# Altium schematic sheet DB10012_ControlController.SchDoc: Microcontroller
size A3; SheetNumber: 5; SheetTotal: 6
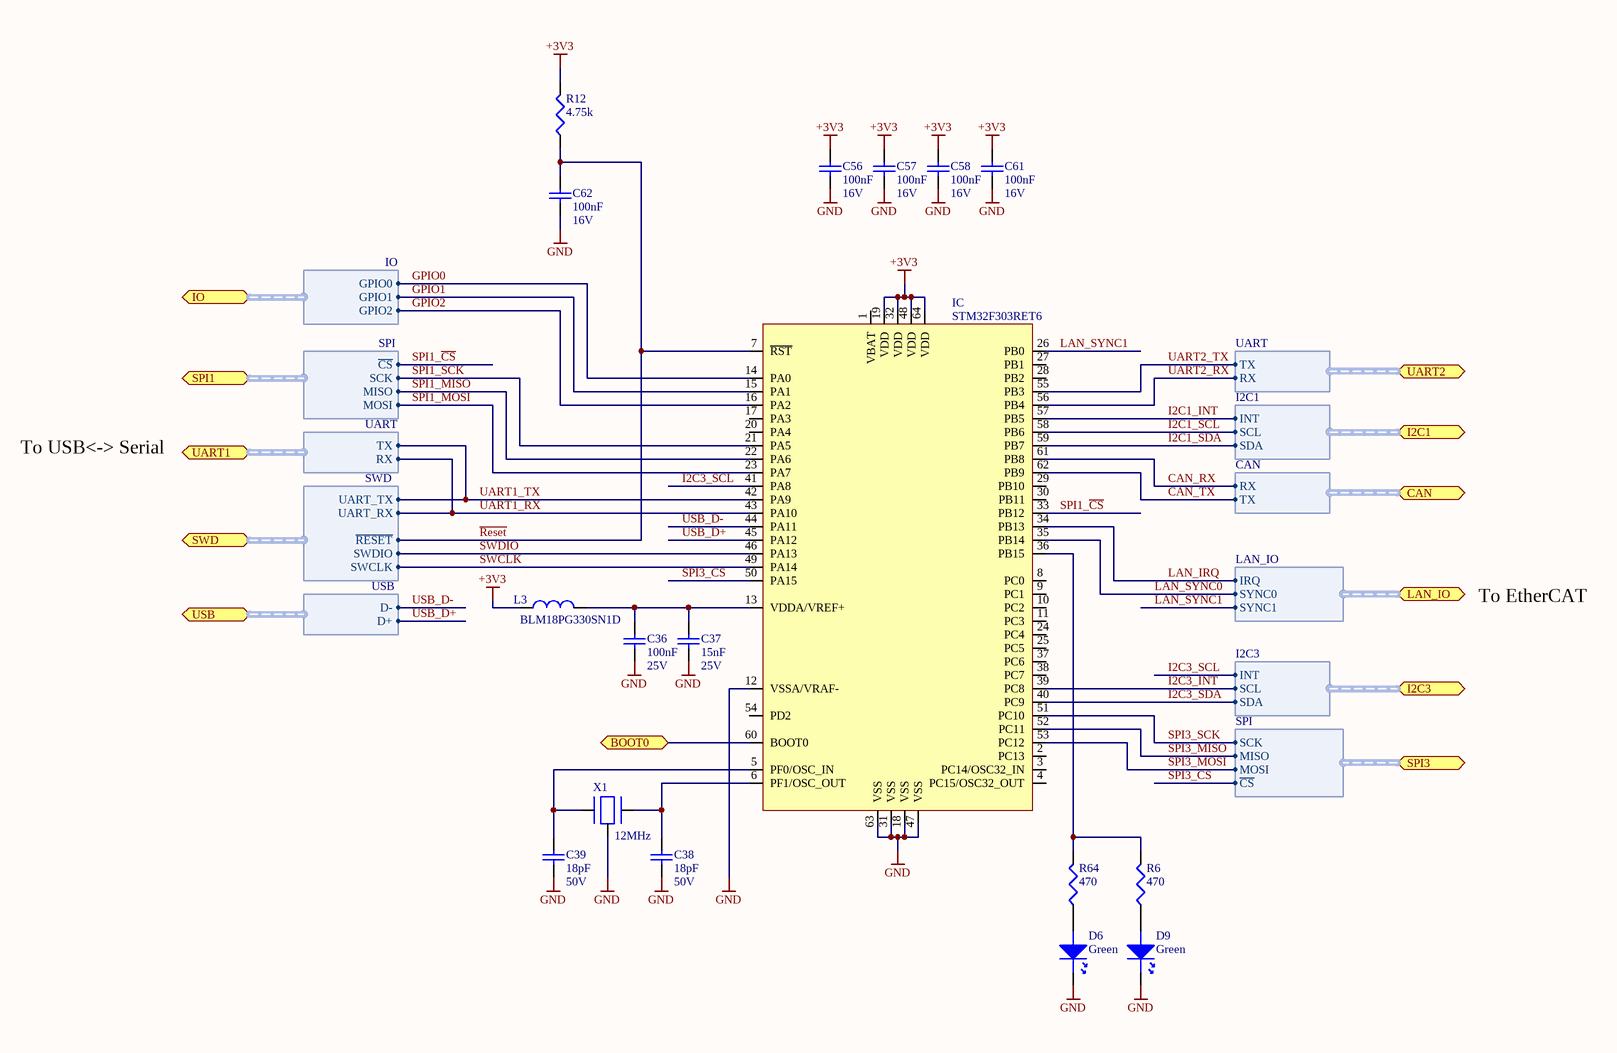
[diagram p0: DB10012_ControlController.SchDoc]

## Parts
C36  100nF  Voltage Rating: 25V  [C0402]
C37  15nF  Voltage Rating: 25V  [C0402]
C38  18pF  Voltage Rating: 50V  [C0402]
C39  18pF  Voltage Rating: 50V  [C0402]
C56  100nF  Voltage Rating: 16V  [C0402]
C57  100nF  Voltage Rating: 16V  [C0402]
C58  100nF  Voltage Rating: 16V  [C0402]
C61  100nF  Voltage Rating: 16V  [C0402]
C62  100nF  Voltage Rating: 16V  [C0402]
D6  Green  [D-0805]
D9  Green  [D-0805]
IC  STM32F303RET6  [LQFP64]
L3  BLM18PG330SN1D  [L0603]
R6  470  [0402]
R12  4.75k  [0402]
R64  470  [0402]
X1  12MHz  [7M]

## Ports
BOOT0, CAN (harness CAN), I2C1 (harness I2C1), I2C3 (harness I2C3), IO (harness IO), LAN_IO (harness LAN_IO), SPI1 (harness SPI), SPI3 (harness SPI), SWD (harness SWD), UART1 (harness UART), UART2 (harness UART), USB (harness USB)

## Harnesses
SWD: UART_TX, UART_RX, SWDIO, SWCLK, ~{RESET}
SPI: SCK, ~{CS}, MOSI, MISO
LAN_IO: IRQ, SYNC0, SYNC1
UART: TX, RX
USB: D-, D+
CAN: TX, RX
I2C1: INT, SCL, SDA
IO: GPIO0, GPIO1, GPIO2
I2C3: INT, SCL, SDA

## Nets
+3V3: C56.2 C57.2 C58.2 C61.2 IC.19(VDD) IC.32(VDD) IC.48(VDD) IC.64(VDD) L3.2 R12.2
GND: C36.1 C37.1 C38.1 C39.1 C56.1 C57.1 C58.1 C61.1 C62.1 D6.K D9.K IC.12(VSSA/VRAF-) IC.18(VSS) IC.31(VSS) IC.47(VSS) IC.63(VSS) X1.0
BOOT0: IC.60(BOOT0) ; port BOOT0
CAN_RX: IC.61(PB8) ; port CAN.RX
CAN_TX: IC.62(PB9) ; port CAN.TX
GPIO0: IC.14(PA0) ; port IO.GPIO0
GPIO1: IC.15(PA1) ; port IO.GPIO1
GPIO2: IC.16(PA2) ; port IO.GPIO2
I2C1_INT: IC.57(PB5) ; port I2C1.INT
I2C1_SCL: IC.58(PB6) ; port I2C1.SCL
I2C1_SDA: IC.59(PB7) ; port I2C1.SDA
I2C3_INT: IC.39(PC8) ; port I2C3.SCL
I2C3_SCL: IC.41(PA8) ; port I2C3.INT
I2C3_SDA: IC.40(PC9) ; port I2C3.SDA
LAN_IRQ: IC.34(PB13) ; port LAN_IO.IRQ
LAN_SYNC0: IC.35(PB14) ; port LAN_IO.SYNC0
LAN_SYNC1: IC.26(PB0) ; port LAN_IO.SYNC1
~{Reset}: C62.2 IC.7(~{RST}) R12.1 ; port SWD.~{RESET}
SPI1_~{CS}: IC.33(PB12) ; port SPI1.~{CS}
SPI1_MISO: IC.22(PA6) ; port SPI1.MISO
SPI1_MOSI: IC.23(PA7) ; port SPI1.MOSI
SPI1_SCK: IC.21(PA5) ; port SPI1.SCK
SPI3_~{CS}: IC.50(PA15) ; port SPI3.~{CS}
SPI3_MISO: IC.52(PC11) ; port SPI3.MISO
SPI3_MOSI: IC.53(PC12) ; port SPI3.MOSI
SPI3_SCK: IC.51(PC10) ; port SPI3.SCK
SWCLK: IC.49(PA14) ; port SWD.SWCLK
SWDIO: IC.46(PA13) ; port SWD.SWDIO
UART1_RX: IC.43(PA10) ; port SWD.UART_RX, port UART1.RX
UART1_TX: IC.42(PA9) ; port SWD.UART_TX, port UART1.TX
UART2_RX: IC.56(PB4) ; port UART2.RX
UART2_TX: IC.55(PB3) ; port UART2.TX
USB_D+: IC.45(PA12) ; port USB.D+
USB_D-: IC.44(PA11) ; port USB.D-
NetC36_2: C36.2 C37.2 IC.13(VDDA/VREF+) L3.1
NetC38_2: C38.2 IC.6(PF1/OSC_OUT) X1.1
NetC39_2: C39.2 IC.5(PF0/OSC_IN) X1.2
NetD6_A: D6.A R64.1
NetD9_A: D9.A R6.1
NetIC_36: IC.36(PB15) R6.2 R64.2

Not connected (* = marked no-connect by the designer): IC 1(VBAT) 2(PC13) 3(PC14/OSC32_IN) 4(PC15/OSC32_OUT) 8(PC0) 9(PC1) 10(PC2) 11(PC3) 17(PA3) 20(PA4) 24(PC4) 25(PC5) 27(PB1) 28(PB2) 29(PB10) 30(PB11) 37(PC6) 38(PC7) 54(PD2)

## Notes on the sheet
- To USB<-> Serial
- To EtherCAT
- Title
- Size:
- Date:
- A3
- Number:
- Time:
- Revision:
- Sheet
- of
- File:

## Library data of the parts
C36 = 100nF/0402/CER/25V: Capacitor, 100nF, 25V, X7R; Capacitance Tolerance: 10nF; Capacitor Case Style: 0402; Brand Number: GRM155R71E104KE14D; Brand: MULTICOMP; Dielectric Characteristic: X7R; Capacitance: 100nF; Temperature Range: -55 to +125 C; Price: 0,0225; Order Code Supplier: 2456106; Supplier: Farnell
C37 = 15nF/0402/CER/25V: Capacitor, 15nF, 25V, X7R; Capacitance Tolerance: +/-10%; Capacitor Case Style: 0402; Brand Number: GRM155R71E153KA61D; Brand: Murata; Dielectric Characteristic: X7R; Capacitance: 15nF; Temperature Range: -55°C to 125°C; Price: 0,0267; Order Code Supplier: 2470470; Supplier: Farnell
C38 C39 = 18pF/0402/CER/50V: Capacitor, 18pF, 50V, NP0; Capacitance Tolerance: ± 5%; Capacitor Case Style: 0402; Brand Number: GRM1555C1H180JA01D; Brand: MURATA; Dielectric Characteristic: NP0; Capacitance: 18pF; Temperature Range: -55°C to 125°C; Price: 0,0177; Order Code Supplier: 1828876; Supplier: Farnell
C56-C58 C61 C62 = 100nF/0402/CER/16V: Capacitor, 100nF, 16V, X7R; Capacitance Tolerance: 10nF; Capacitor Case Style: 0402; Brand Number: GRM155R71C104KA88D; Brand: MURATA; Dielectric Characteristic: X7R; Capacitance: 100nF; Temperature Range: -55 to +125 C; Price: 0,001; Order Code Supplier: 2408523; Supplier: Farnell
D6 D9 = KP-2012SGC: Led, Green, Li:12mcd, Vf:2.2V, If:0.02A; Brand: KingBright; Case Style: 0805; Forward Current: 0.02A; Forward Voltage: 2.2V; Luminous Intensity: 12mcd; Brand Number: KP-2012SGC; Order Code Supplier: 1318243; Price: 0,06; Supplier: Farnell; Temperature Range: -30°C to +85°C
IC = STM32F303RET6: ARM Cortex-M4, 72 MHz, 512 KB, 64 KB, 64; Brand: STM; Brand Number: STM32F303RET6; Supplier: Farnell; Order Code Supplier: 2466939
L3 = BLM18PG330SN1D: Ferrite Bead, Impedance:33ohm, DC Resistance Max:0.025ohm, DC Current Rating:3A; Brand: MURATA; Case Style: 0603; Brand Number: BLM18PG330SN1D; Price: 0,048; Supplier: Farnell; Order Code Supplier: 1515742
R6 R64 = 470/0402/0063W/50V: Resistor, 470, 1%, 0.0625W, 50V, 100PPM, 0402; Brand: VISHAY DRALORIC; Brand Number: CRG0402F470R; Power Rating: 0.063W; Case Style: 0402; Order Code Supplier: 2331533; Price: 0,0099; Resistance: 470; Supplier: Farnell; Temperature Coefficient: ± 100PPM; Temperature Range: -55°C to +125°C; Voltage Rating: 50V
R12 = 4.75k/0402/0063W/50V: Resistor, 4.75k, 0.1%, 0.0625W, 50V, 100PPM, 0402; Brand: VISHAY DRALORIC; Brand Number: CRCW04024K75FKED; Power Rating: 0.063W; Case Style: 0402; Order Code Supplier: 2121689; Price: 0,0006; Resistance: 4.75k; Supplier: Farnell; Temperature Coefficient: ± 100PPM; Temperature Range: -55°C to +125°C; Voltage Rating: 50V
X1 = 7M-12.000MAAJ-T: CRYSTAL, 12MHz,18PF CL, 3.2X2.5MM SMT; Brand: TXC; Order Code Supplier: 1842056; Price: 1,45; Supplier: Farnell; Brand Number: 7M-12.000MAAJ-T